# Altium project MAD17.PrjPcb
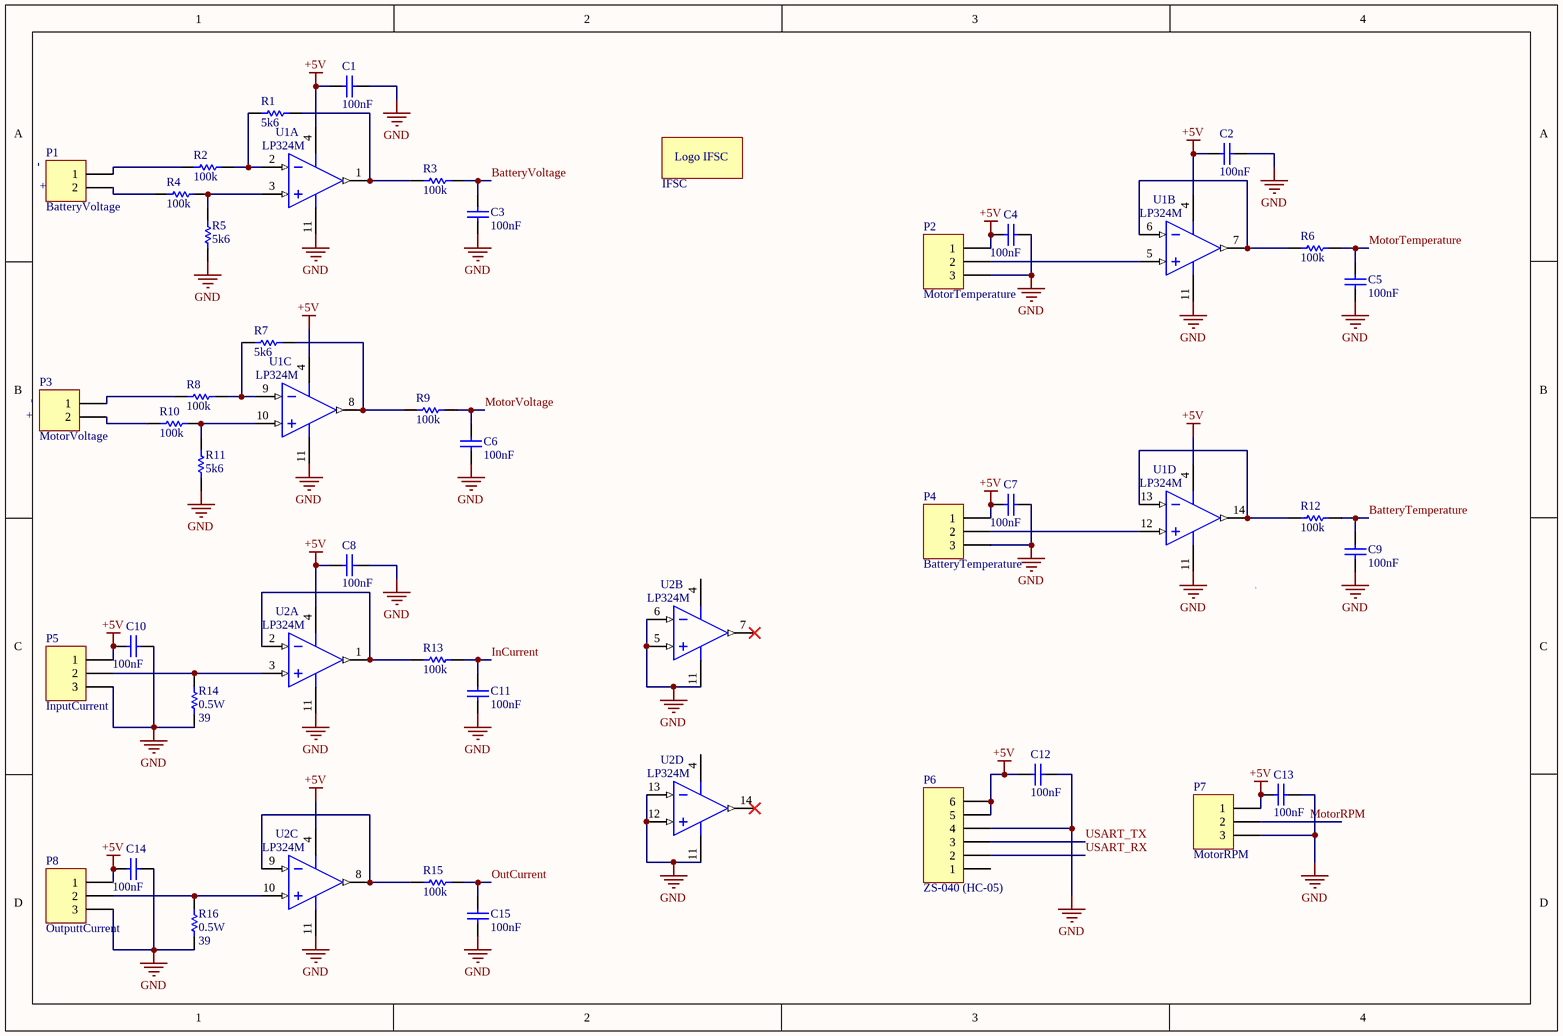
[diagram p0: Sensores.SchDoc]
2 sheets, 72 parts. Net scope: global (net labels, ports and power ports of the same name join across sheets).
Board file: Mad17(grr).PcbDoc
Sheets:
  Sensores.SchDoc
  atmega.SchDoc

## Sheet Sensores.SchDoc
size A4; Date: 09 July 2012; Author: Simon Markham; DrawnBy: Simon Markham; Engineer: Simon Markham; Organization: Markham Designs

### Parts
C1  value 100nF  [0805C]  (hidden comment: 0805)
C2  value 100nF  [0805C]  (hidden comment: 0805)
C3  value 100nF  [0805C]  (hidden comment: 0805)
C4  value 100nF  [0805C]  (hidden comment: 0805)
C5  value 100nF  [0805C]  (hidden comment: 0805)
C6  value 100nF  [0805C]  (hidden comment: 0805)
C7  value 100nF  [0805C]  (hidden comment: 0805)
C8  value 100nF  [0805C]  (hidden comment: 0805)
C9  value 100nF  [0805C]  (hidden comment: 0805)
C10  value 100nF  [0805C]  (hidden comment: 0805)
C11  value 100nF  [0805C]  (hidden comment: 0805)
C12  value 100nF  [0805C]  (hidden comment: 0805)
C13  value 100nF  [0805C]  (hidden comment: 0805)
C14  value 100nF  [0805C]  (hidden comment: 0805)
C15  value 100nF  [0805C]  (hidden comment: 0805)
P1  BatteryVoltage  [KRE_2]
P2  MotorTemperature  [KRE_3]
P3  MotorVoltage  [KRE_2]
P4  BatteryTemperature  [KRE_3]
P5  InputCurrent  [KRE_3]
P6  ZS-040 (HC-05)  [Header 6x1 8.5mm]
P7  MotorRPM  [KRE_3]
P8  OutputtCurrent  [KRE_3]
R1  value 5k6  [0805R]  (hidden comment: Res1)
R2  value 100k  [0805R]  (hidden comment: Res1)
R3  value 100k  [0805R]  (hidden comment: Res1)
R4  value 100k  [0805R]  (hidden comment: Res1)
R5  value 5k6  [0805R]  (hidden comment: Res1)
R6  value 100k  [0805R]  (hidden comment: Res1)
R7  value 5k6  [0805R]  (hidden comment: Res1)
R8  value 100k  [0805R]  (hidden comment: Res1)
R9  value 100k  [0805R]  (hidden comment: Res1)
R10  value 100k  [0805R]  (hidden comment: Res1)
R11  value 5k6  [0805R]  (hidden comment: Res1)
R12  value 100k  [0805R]  (hidden comment: Res1)
R13  value 100k  [0805R]  (hidden comment: Res1)
R14  0.5W  value 39  [R700-4.0mm]
R15  value 100k  [0805R]  (hidden comment: Res1)
R16  0.5W  value 39  [R700-4.0mm]
U1  LP324M  [SOIC14-150(50)]  (parts A,B,C,D of 4)
U2  LP324M  [SOIC14-150(50)]  (parts A,B,C,D of 4)
X?  IFSC  [IFSC_SILK]

### Nets
+5V: C1.1 C2.1 C4.1 C7.1 C8.1 C10.1 C12.1 C13.1 C14.1 P2.1 P4.1 P5.1 P6.5 P6.6 P7.1 P8.1 U1.4(V+) U2.4(V+)
GND: C1.2 C2.2 C3.1 C4.2 C5.1 C6.1 C7.2 C8.2 C9.1 C10.2 C11.1 C12.2 C13.2 C14.2 C15.1 P2.3 P4.3 P5.3 P6.4 P7.3 P8.3 R5.1 R11.2 R14.1 R16.1 U1.11(GND) U2.5(IN2+) U2.6(IN2-) U2.11(GND) U2.12(IN4+) U2.13(IN4-)  [project net CAN_GND]
BatteryTemperature: C9.2 R12.2
BatteryVoltage: C3.2 R3.2
InCurrent: C11.2 R13.2
MotorRPM: P7.2
MotorTemperature: C5.2 R6.2
MotorVoltage: C6.2 R9.2
OutCurrent: C15.2 R15.2
USART_RX: P6.2
USART_TX: P6.3
NetP1_1: P1.1 R2.1
NetP1_2: P1.2 R4.1
NetP2_2: P2.2 U1.5(IN2+)
NetP3_1: P3.1 R8.1
NetP3_2: P3.2 R10.1
NetP4_2: P4.2 U1.12(IN4+)
NetP5_2: P5.2 R14.2 U2.3(IN1+)
NetP8_2: P8.2 R16.2 U2.10(IN3+)
NetR1_1: R1.1 R2.2 U1.2(IN1-)
NetR1_2: R1.2 R3.1 U1.1(OUT1)
NetR4_2: R4.2 R5.2 U1.3(IN1+)
NetR6_1: R6.1 U1.6(IN2-) U1.7(OUT2)
NetR7_1: R7.1 R8.2 U1.9(IN3-)
NetR7_2: R7.2 R9.1 U1.8(OUT3)
NetR10_2: R10.2 R11.1 U1.10(IN3+)
NetR12_1: R12.1 U1.13(IN4-) U1.14(OUT4)
NetR13_1: R13.1 U2.1(OUT1) U2.2(IN1-)
NetR15_1: R15.1 U2.8(OUT3) U2.9(IN3-)

Not connected (* = marked no-connect by the designer): P6 1; U2 7(OUT2)* 14(OUT4)*

### Notes on the sheet
- (near P1) -
- (near P1) +
- (near P3) +
- (near P3) -
- (in symbol IFSC) Logo IFSC

### Library data of the parts
C1-C15 = Cap: Capacitor
P1 P3 = KRE_2: Terminal Block 1x2
P2 P4 P5 P7 P8 = KRE_3: Terminal Block 1x3
P6 = KRE_6: Terminal Block 1x6
R1-R16 = Res1: Resistor
U1 U2 = LP324M: Micropower Quad Operational Amplifier; Manufacturer: National Semiconductor; CompType: Amplifiers; PackageTopMarking: NSUZXYTT*LP324M; PowerWise: N; Published: 4-Dec-2008; DatasheetVersion: Jul-2001; PackageVersion: revJ, Jan-1996; PackageReference: M14A; Publisher: Altium Limited; PackageDescription: Molded Package S.O., .150in Wide, 14 Lead; PartNumber: LP324M; RoHS: O; PinCount: 14; DigiKeyPartNumber: LP324MXCT-ND; Code_JEDEC: MS-012AB; Code_IPC: SOIC127P600-14; ComponentLink1Description: LP324 Datasheet; ComponentLink1URL: http://www.national.com/ds/LP/LP324.pdf; ComponentLink2Description: LP324 Web Page; ComponentLink2URL: http://www.national.com/pf/LP/LP324.html; ComponentLink3Description: M14A Package Page; ComponentLink3URL: http://www.national.com/packaging/folders/m14a.html
X? = IFSC: Logomarca IFSC

## Sheet atmega.SchDoc
size A4
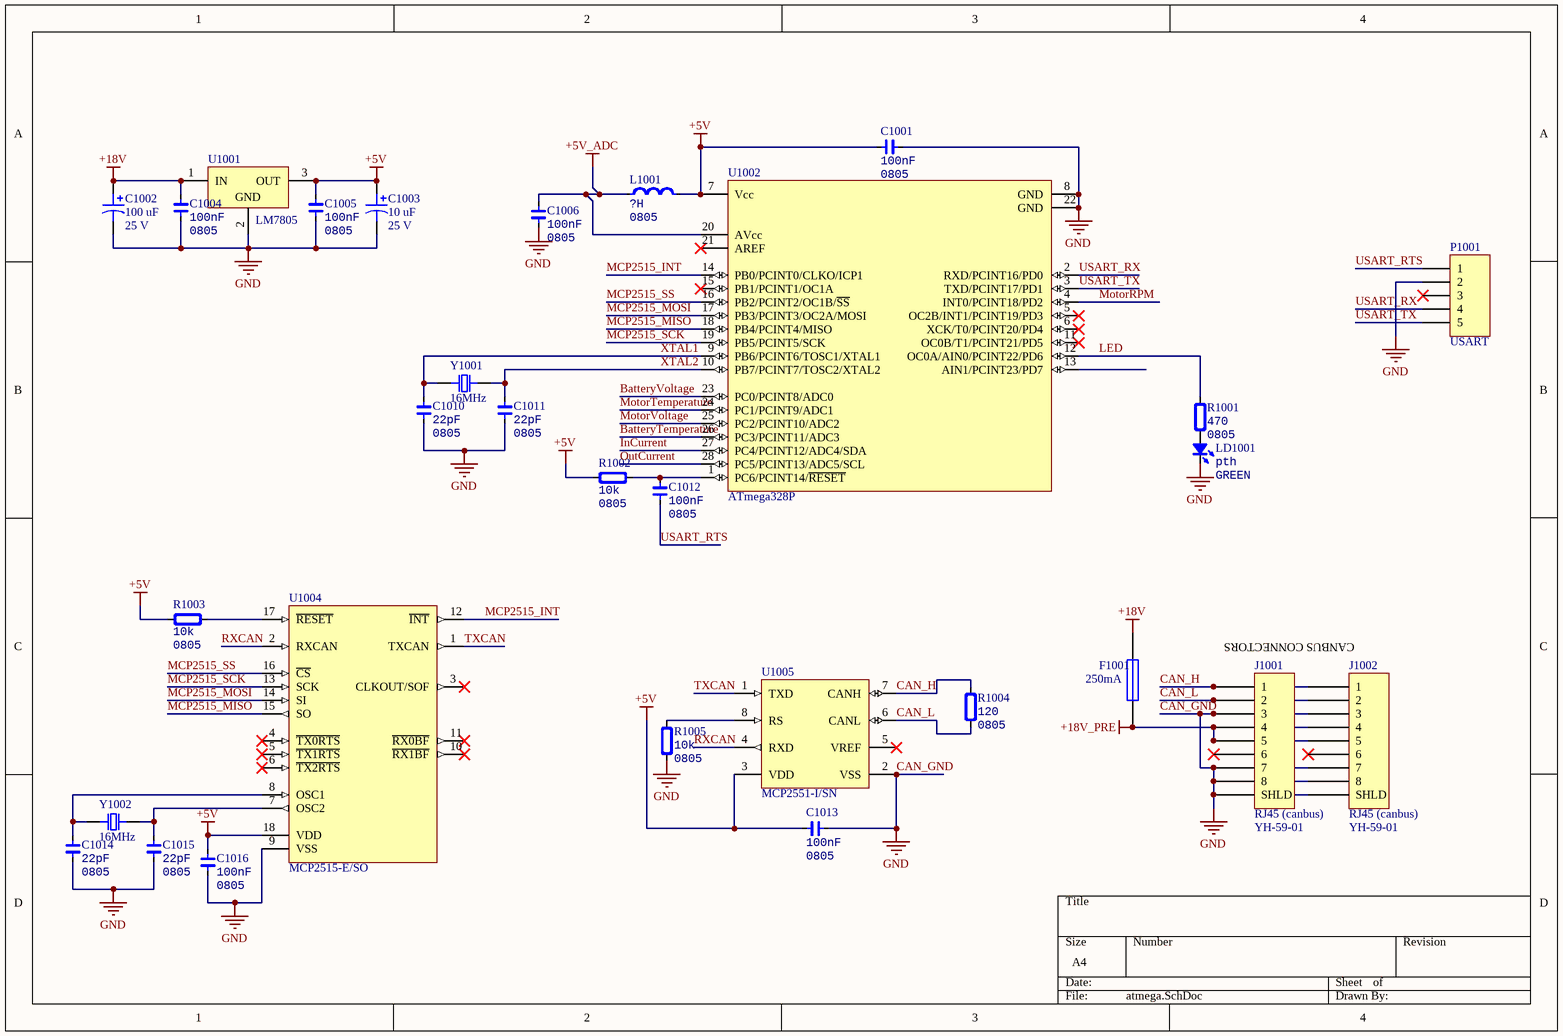
[diagram p1: atmega.SchDoc]

### Parts
C1001  Type: 0805  [0805C]  (hidden comment: 100nF)
C1002  value 100 uF  Voltage: 25 V  [CP3.5mm-8.0mm]  (hidden comment: CapacitorPol)
C1003  value 10 uF  Voltage: 25 V  [CP3.5mm-8.0mm]  (hidden comment: CapacitorPol)
C1004  Type: 0805  [0805C]  (hidden comment: 100nF)
C1005  Type: 0805  [0805C]  (hidden comment: 100nF)
C1006  Type: 0805  [0805C]  (hidden comment: 100nF)
C1010  Type: 0805  [0805C]  (hidden comment: 22pF)
C1011  Type: 0805  [0805C]  (hidden comment: 22pF)
C1012  Type: 0805  [0805C]  (hidden comment: 100nF)
C1013  Type: 0805  [0805C]  (hidden comment: 100nF)
C1014  Type: 0805  [0805C]  (hidden comment: 22pF)
C1015  Type: 0805  [0805C]  (hidden comment: 22pF)
C1016  Type: 0805  [0805C]  (hidden comment: 100nF)
F1001  250mA  [Porta Fusivel]
J1001  RJ45 (canbus)  value YH-59-01  [ASSMANN A-2004-2-4-LP/FS]
J1002  RJ45 (canbus)  value YH-59-01  [ASSMANN A-2004-2-4-LP/FS]
L1001  Type: 0805  [0805L]  (hidden comment: ?H)
LD1001  Type: pth  [LED3MM]  (hidden comment: GREEN)
P1001  USART  [HDR1X5]
R1001  Type: 0805  [0805R]  (hidden comment: 470)
R1002  Type: 0805  [0805R]  (hidden comment: 10k)
R1003  Type: 0805  [0805R]  (hidden comment: 10k)
R1004  Type: 0805  [0805R]  (hidden comment: 120)
R1005  Type: 0805  [0805R]  (hidden comment: 10k)
U1001  LM7805  [TO220_deitado]
U1002  ATmega328P  [DIP28-300(100)]
U1004  MCP2515-E/SO  [WSO18_L]
U1005  MCP2551-I/SN  [SOIC08-150(50)]
Y1001  16MHz  [HC49-US-THT]
Y1002  16MHz  [HC49-US-THT]

### Nets
+5V: C1001.1 C1003.1 C1005.2 C1013.1 C1016.1 L1001.2 R1002.1 R1003.1 U1001.3(OUT) U1002.7(Vcc) U1004.18(VDD) U1005.3(VDD)
+5V_ADC: C1006.2 L1001.1 U1002.20(AVcc)
+18V: C1002.1 C1004.2 F1001.1 U1001.1(IN)
+18V_PRE: F1001.2 J1001.4 J1001.5 J1002.4 J1002.5
CAN_GND: C1001.2 C1002.2 C1003.2 C1004.1 C1005.1 C1006.1 C1010.1 C1011.1 C1013.2 C1014.1 C1015.1 C1016.2 J1001.3 J1001.7 J1001.8 J1001.S(SHLD) J1002.3 J1002.7 J1002.8 J1002.S(SHLD) LD1001.2(K) P1001.2 R1005.2 U1001.2(GND) U1002.8(GND) U1002.22(GND) U1004.9(VSS) U1005.2(VSS)  [also labelled GND]
BatteryTemperature: U1002.26(PC3/PCINT11/ADC3)
BatteryVoltage: U1002.23(PC0/PCINT8/ADC0)
CAN_H: J1001.1 J1002.1 R1004.2 U1005.7(CANH)
CAN_L: J1001.2 J1002.2 R1004.1 U1005.6(CANL)
InCurrent: U1002.27(PC4/PCINT12/ADC4/SDA)
LED: R1001.2 U1002.12(OC0A/AIN0/PCINT22/PD6)
MCP2515_INT: U1002.14(PB0/PCINT0/CLKO/ICP1) U1004.12(~{INT})
MCP2515_MISO: U1002.18(PB4/PCINT4/MISO) U1004.15(SO)
MCP2515_MOSI: U1002.17(PB3/PCINT3/OC2A/MOSI) U1004.14(SI)
MCP2515_SCK: U1002.19(PB5/PCINT5/SCK) U1004.13(SCK)
MCP2515_SS: U1002.16(PB2/PCINT2/OC1B/~{SS}) U1004.16(~{CS})
MotorRPM: U1002.4(INT0/PCINT18/PD2)
MotorTemperature: U1002.24(PC1/PCINT9/ADC1)
MotorVoltage: U1002.25(PC2/PCINT10/ADC2)
OutCurrent: U1002.28(PC5/PCINT13/ADC5/SCL)
RXCAN: U1004.2(RXCAN) U1005.4(RXD)
TXCAN: U1004.1(TXCAN) U1005.1(TXD)
USART_RTS: C1012.2 P1001.1
USART_RX: P1001.4 U1002.2(RXD/PCINT16/PD0)
USART_TX: P1001.5 U1002.3(TXD/PCINT17/PD1)
XTAL1: C1010.2 U1002.9(PB6/PCINT6/TOSC1/XTAL1) Y1001.1
XTAL2: C1011.2 U1002.10(PB7/PCINT7/TOSC2/XTAL2) Y1001.2
NetC1012_1: C1012.1 R1002.2 U1002.1(PC6/PCINT14/~{RESET})
NetC1014_2: C1014.2 U1004.8(OSC1) Y1002.1
NetC1015_2: C1015.2 U1004.7(OSC2) Y1002.2
NetLD1001_1: LD1001.1(A) R1001.1
NetR1003_2: R1003.2 U1004.17(~{RESET})
NetR1005_1: R1005.1 U1005.8(RS)

Not connected (* = marked no-connect by the designer): J1001 6*; J1002 6*; P1001 3*; U1002 5(OC2B/INT1/PCINT19/PD3)* 6(XCK/T0/PCINT20/PD4)* 11(OC0B/T1/PCINT21/PD5)* 13(AIN1/PCINT23/PD7) 15(PB1/PCINT1/OC1A)* 21(AREF)*; U1004 3(CLKOUT/SOF)* 4(~{TX0RTS})* 5(~{TX1RTS})* 6(~{TX2RTS})* 10(~{RX1BF})* 11(~{RX0BF})*; U1005 5(VREF)*

### Notes on the sheet
- CANBUS CONNECTORS

### Library data of the parts
C1001 C1004-C1006 C1010-C1016 = Cap_0805: Capacitor
  C1001 C1004-C1006 C1012 C1013 C1016: Value: 100nF
  C1010 C1011 C1014 C1015: Value: 22pF
C1002 C1003 = CapacitorPol: Solid Aluminum Capacitor with Organic Semiconductor Electrolyte: 100uF, 10V, Bulk Pack; PackageReference: E
F1001 = Fuse 1: Fuse; LatestRevisionNote: Re-released for DXP Platform.; PackageReference: PIN-W2/E2.8
J1001 J1002 = Modular Jack with Shield: YH-59-01
L1001 = Ind_0805: Inductor; Value: ?H
LD1001 = LED_0805: LED; Value: GREEN
P1001 = Header 5: Header, 5-Pin; LatestRevisionNote: Re-released for DXP Platform.
R1001-R1005 = Res_0805: Resistor
  R1001: Value: 470
  R1002 R1003 R1005: Value: 10k
  R1004: Value: 120
U1001 = µA7805CKC: Positive-Voltage Regulator; PackageReference: KC03
U1002 = ATmega328P: 8-bit AVR Microcontroller, 32KB Flash, 1KB EEPROM, 2KB SRAM, 28-pin PDIP, Industrial Grade (-40°C to 85°C); PackageReference: 28P3
U1004 = CMP-0186-00035-2: Stand-Alone CAN Controller With SPI Interface, 18-Pin SOIC, Extended Temperature; PackageReference: SOIC-SO18
U1005 = CMP-1721-00003-1: High-Speed CAN Transceiver, / 1 Mb/s, 4.5 to 5.5 V, 8-Pin SOIC (SN), Industrial Temperature, RoHS, Tube; PackageReference: SN8
Y1001 Y1002 = Crystal

## Nets that join several sheets
+5V: Sensores (18 pins), atmega (12 pins)
CAN_GND: Sensores (31 pins), atmega (28 pins)
BatteryTemperature: Sensores (C9.2 R12.2), atmega (U1002.26)
BatteryVoltage: Sensores (C3.2 R3.2), atmega (U1002.23)
InCurrent: Sensores (C11.2 R13.2), atmega (U1002.27)
MotorRPM: Sensores (P7.2), atmega (U1002.4)
MotorTemperature: Sensores (C5.2 R6.2), atmega (U1002.24)
MotorVoltage: Sensores (C6.2 R9.2), atmega (U1002.25)
OutCurrent: Sensores (C15.2 R15.2), atmega (U1002.28)
USART_RX: Sensores (P6.2), atmega (P1001.4 U1002.2)
USART_TX: Sensores (P6.3), atmega (P1001.5 U1002.3)